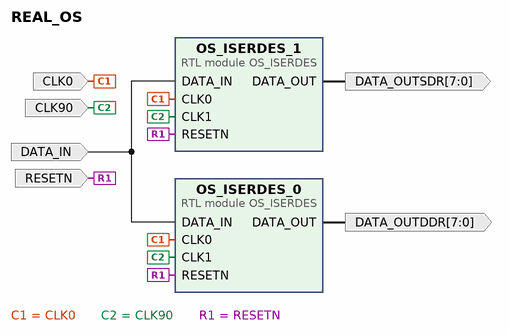
[diagram p0: block diagram of the top level]
# Vivado block design REAL_OS, xc7z020clg400-1, Vivado 2019.1
create_bd_design REAL_OS

create_bd_port -dir I CLK0
create_bd_port -dir I CLK90
create_bd_port -dir I DATA_IN
create_bd_port -dir I RESETN
create_bd_port -dir O -from 7 -to 0 DATA_OUTDDR
create_bd_port -dir O -from 7 -to 0 DATA_OUTSDR

create_bd_cell -type module -reference OS_ISERDES OS_ISERDES_0
set_property -dict {CONFIG.mode DDR CONFIG.o_width 8} [get_bd_cells OS_ISERDES_0]
create_bd_cell -type module -reference OS_ISERDES OS_ISERDES_1
set_property -dict {CONFIG.mode SDR CONFIG.o_width 4} [get_bd_cells OS_ISERDES_1]

# ---- connections ----

connect_bd_net -net CLK0_1 [get_bd_ports CLK0] [get_bd_pins OS_ISERDES_0/CLK0] [get_bd_pins OS_ISERDES_1/CLK0]
connect_bd_net -net CLK90_1 [get_bd_ports CLK90] [get_bd_pins OS_ISERDES_0/CLK1] [get_bd_pins OS_ISERDES_1/CLK1]
connect_bd_net [get_bd_ports DATA_IN] [get_bd_pins OS_ISERDES_0/DATA_IN] [get_bd_pins OS_ISERDES_1/DATA_IN]
connect_bd_net [get_bd_ports RESETN] [get_bd_pins OS_ISERDES_0/RESETN] [get_bd_pins OS_ISERDES_1/RESETN]
connect_bd_net [get_bd_pins OS_ISERDES_0/DATA_OUT] [get_bd_ports DATA_OUTDDR]
connect_bd_net [get_bd_pins OS_ISERDES_1/DATA_OUT] [get_bd_ports DATA_OUTSDR]

validate_bd_design
save_bd_design
